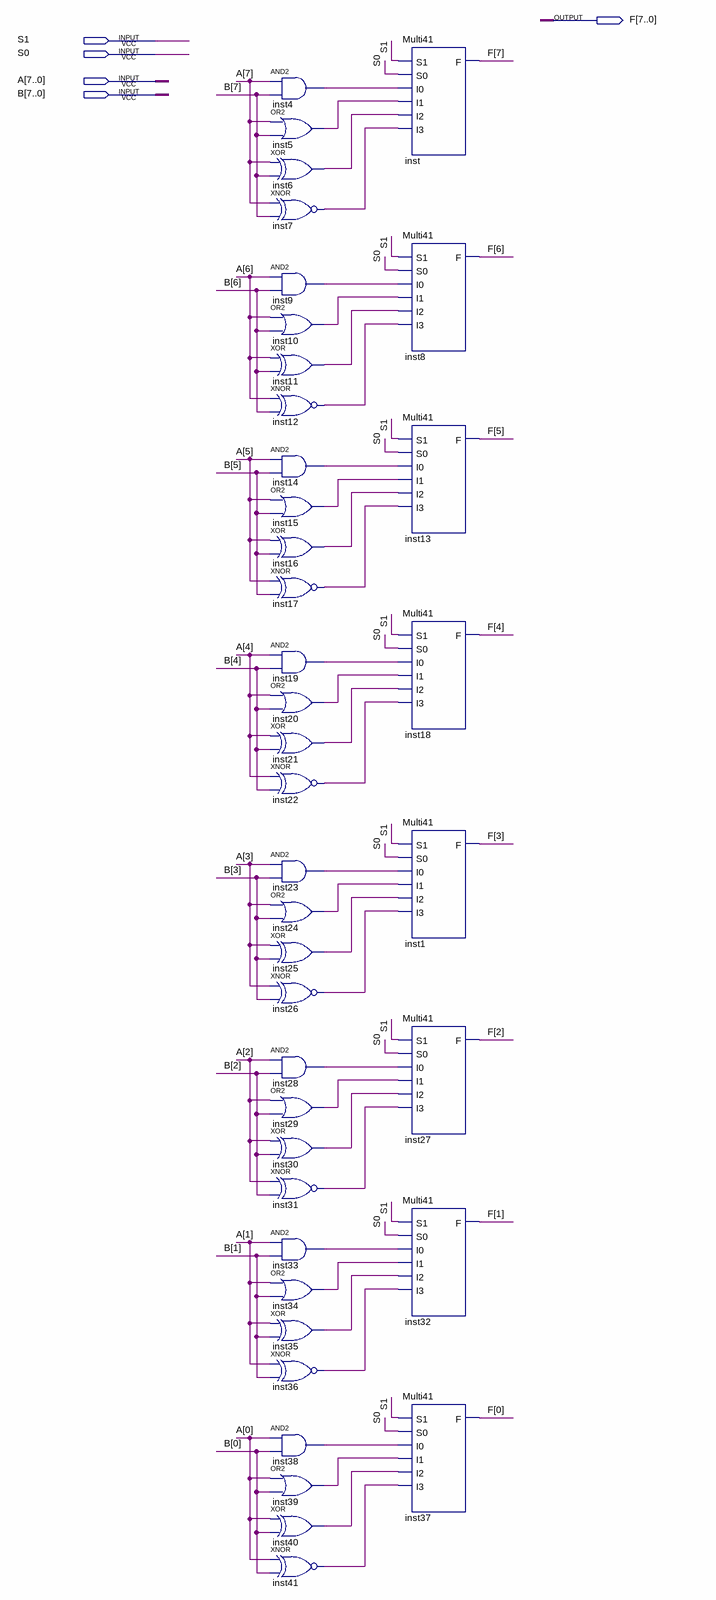
[diagram p0: schematic sheet]
// Quartus schematic LogicUnit.bdf as structural Verilog: 40 symbols, 5 pins
module LogicUnit (
  input  S1,
  input  S0,
  input  [7:0] A,
  input  [7:0] B,
  output [7:0] F
);

  wire inst4_out, inst5_out, inst6_out, inst7_out, inst9_out, inst10_out, inst11_out, inst12_out, inst14_out,
       inst15_out, inst16_out, inst17_out, inst19_out, inst20_out, inst21_out, inst22_out, inst23_out,
       inst24_out, inst25_out, inst26_out, inst28_out, inst29_out, inst30_out, inst31_out, inst33_out,
       inst34_out, inst35_out, inst36_out, inst38_out, inst39_out, inst40_out, inst41_out;

  and inst4 (inst4_out, A[7], B[7]);
  or inst5 (inst5_out, A[7], B[7]);
  xor inst6 (inst6_out, A[7], B[7]);
  xnor inst7 (inst7_out, A[7], B[7]);
  and inst9 (inst9_out, A[6], B[6]);
  or inst10 (inst10_out, A[6], B[6]);
  xor inst11 (inst11_out, A[6], B[6]);
  xnor inst12 (inst12_out, A[6], B[6]);
  and inst14 (inst14_out, A[5], B[5]);
  or inst15 (inst15_out, A[5], B[5]);
  xor inst16 (inst16_out, A[5], B[5]);
  xnor inst17 (inst17_out, A[5], B[5]);
  and inst19 (inst19_out, A[4], B[4]);
  or inst20 (inst20_out, A[4], B[4]);
  xor inst21 (inst21_out, A[4], B[4]);
  xnor inst22 (inst22_out, A[4], B[4]);
  and inst23 (inst23_out, A[3], B[3]);
  or inst24 (inst24_out, A[3], B[3]);
  xor inst25 (inst25_out, A[3], B[3]);
  xnor inst26 (inst26_out, A[3], B[3]);
  and inst28 (inst28_out, A[2], B[2]);
  or inst29 (inst29_out, A[2], B[2]);
  xor inst30 (inst30_out, A[2], B[2]);
  xnor inst31 (inst31_out, A[2], B[2]);
  and inst33 (inst33_out, A[1], B[1]);
  or inst34 (inst34_out, A[1], B[1]);
  xor inst35 (inst35_out, A[1], B[1]);
  xnor inst36 (inst36_out, A[1], B[1]);
  and inst38 (inst38_out, A[0], B[0]);
  or inst39 (inst39_out, A[0], B[0]);
  xor inst40 (inst40_out, A[0], B[0]);
  xnor inst41 (inst41_out, A[0], B[0]);
  Multi41 inst (.S1(S1), .S0(S0), .I0(inst4_out), .I1(inst5_out), .I2(inst6_out), .I3(inst7_out), .F(F[7]));
  Multi41 inst8 (.S1(S1), .S0(S0), .I0(inst9_out), .I1(inst10_out), .I2(inst11_out), .I3(inst12_out), .F(F[6]));
  Multi41 inst13 (.S1(S1), .S0(S0), .I0(inst14_out), .I1(inst15_out), .I2(inst16_out), .I3(inst17_out), .F(F[5]));
  Multi41 inst18 (.S1(S1), .S0(S0), .I0(inst19_out), .I1(inst20_out), .I2(inst21_out), .I3(inst22_out), .F(F[4]));
  Multi41 inst1 (.S1(S1), .S0(S0), .I0(inst23_out), .I1(inst24_out), .I2(inst25_out), .I3(inst26_out), .F(F[3]));
  Multi41 inst27 (.S1(S1), .S0(S0), .I0(inst28_out), .I1(inst29_out), .I2(inst30_out), .I3(inst31_out), .F(F[2]));
  Multi41 inst32 (.S1(S1), .S0(S0), .I0(inst33_out), .I1(inst34_out), .I2(inst35_out), .I3(inst36_out), .F(F[1]));
  Multi41 inst37 (.S1(S1), .S0(S0), .I0(inst38_out), .I1(inst39_out), .I2(inst40_out), .I3(inst41_out), .F(F[0]));
endmodule
